# Altium schematic sheet P07 DDRC of Hi3519.SchDoc
size 420 x 297 mm
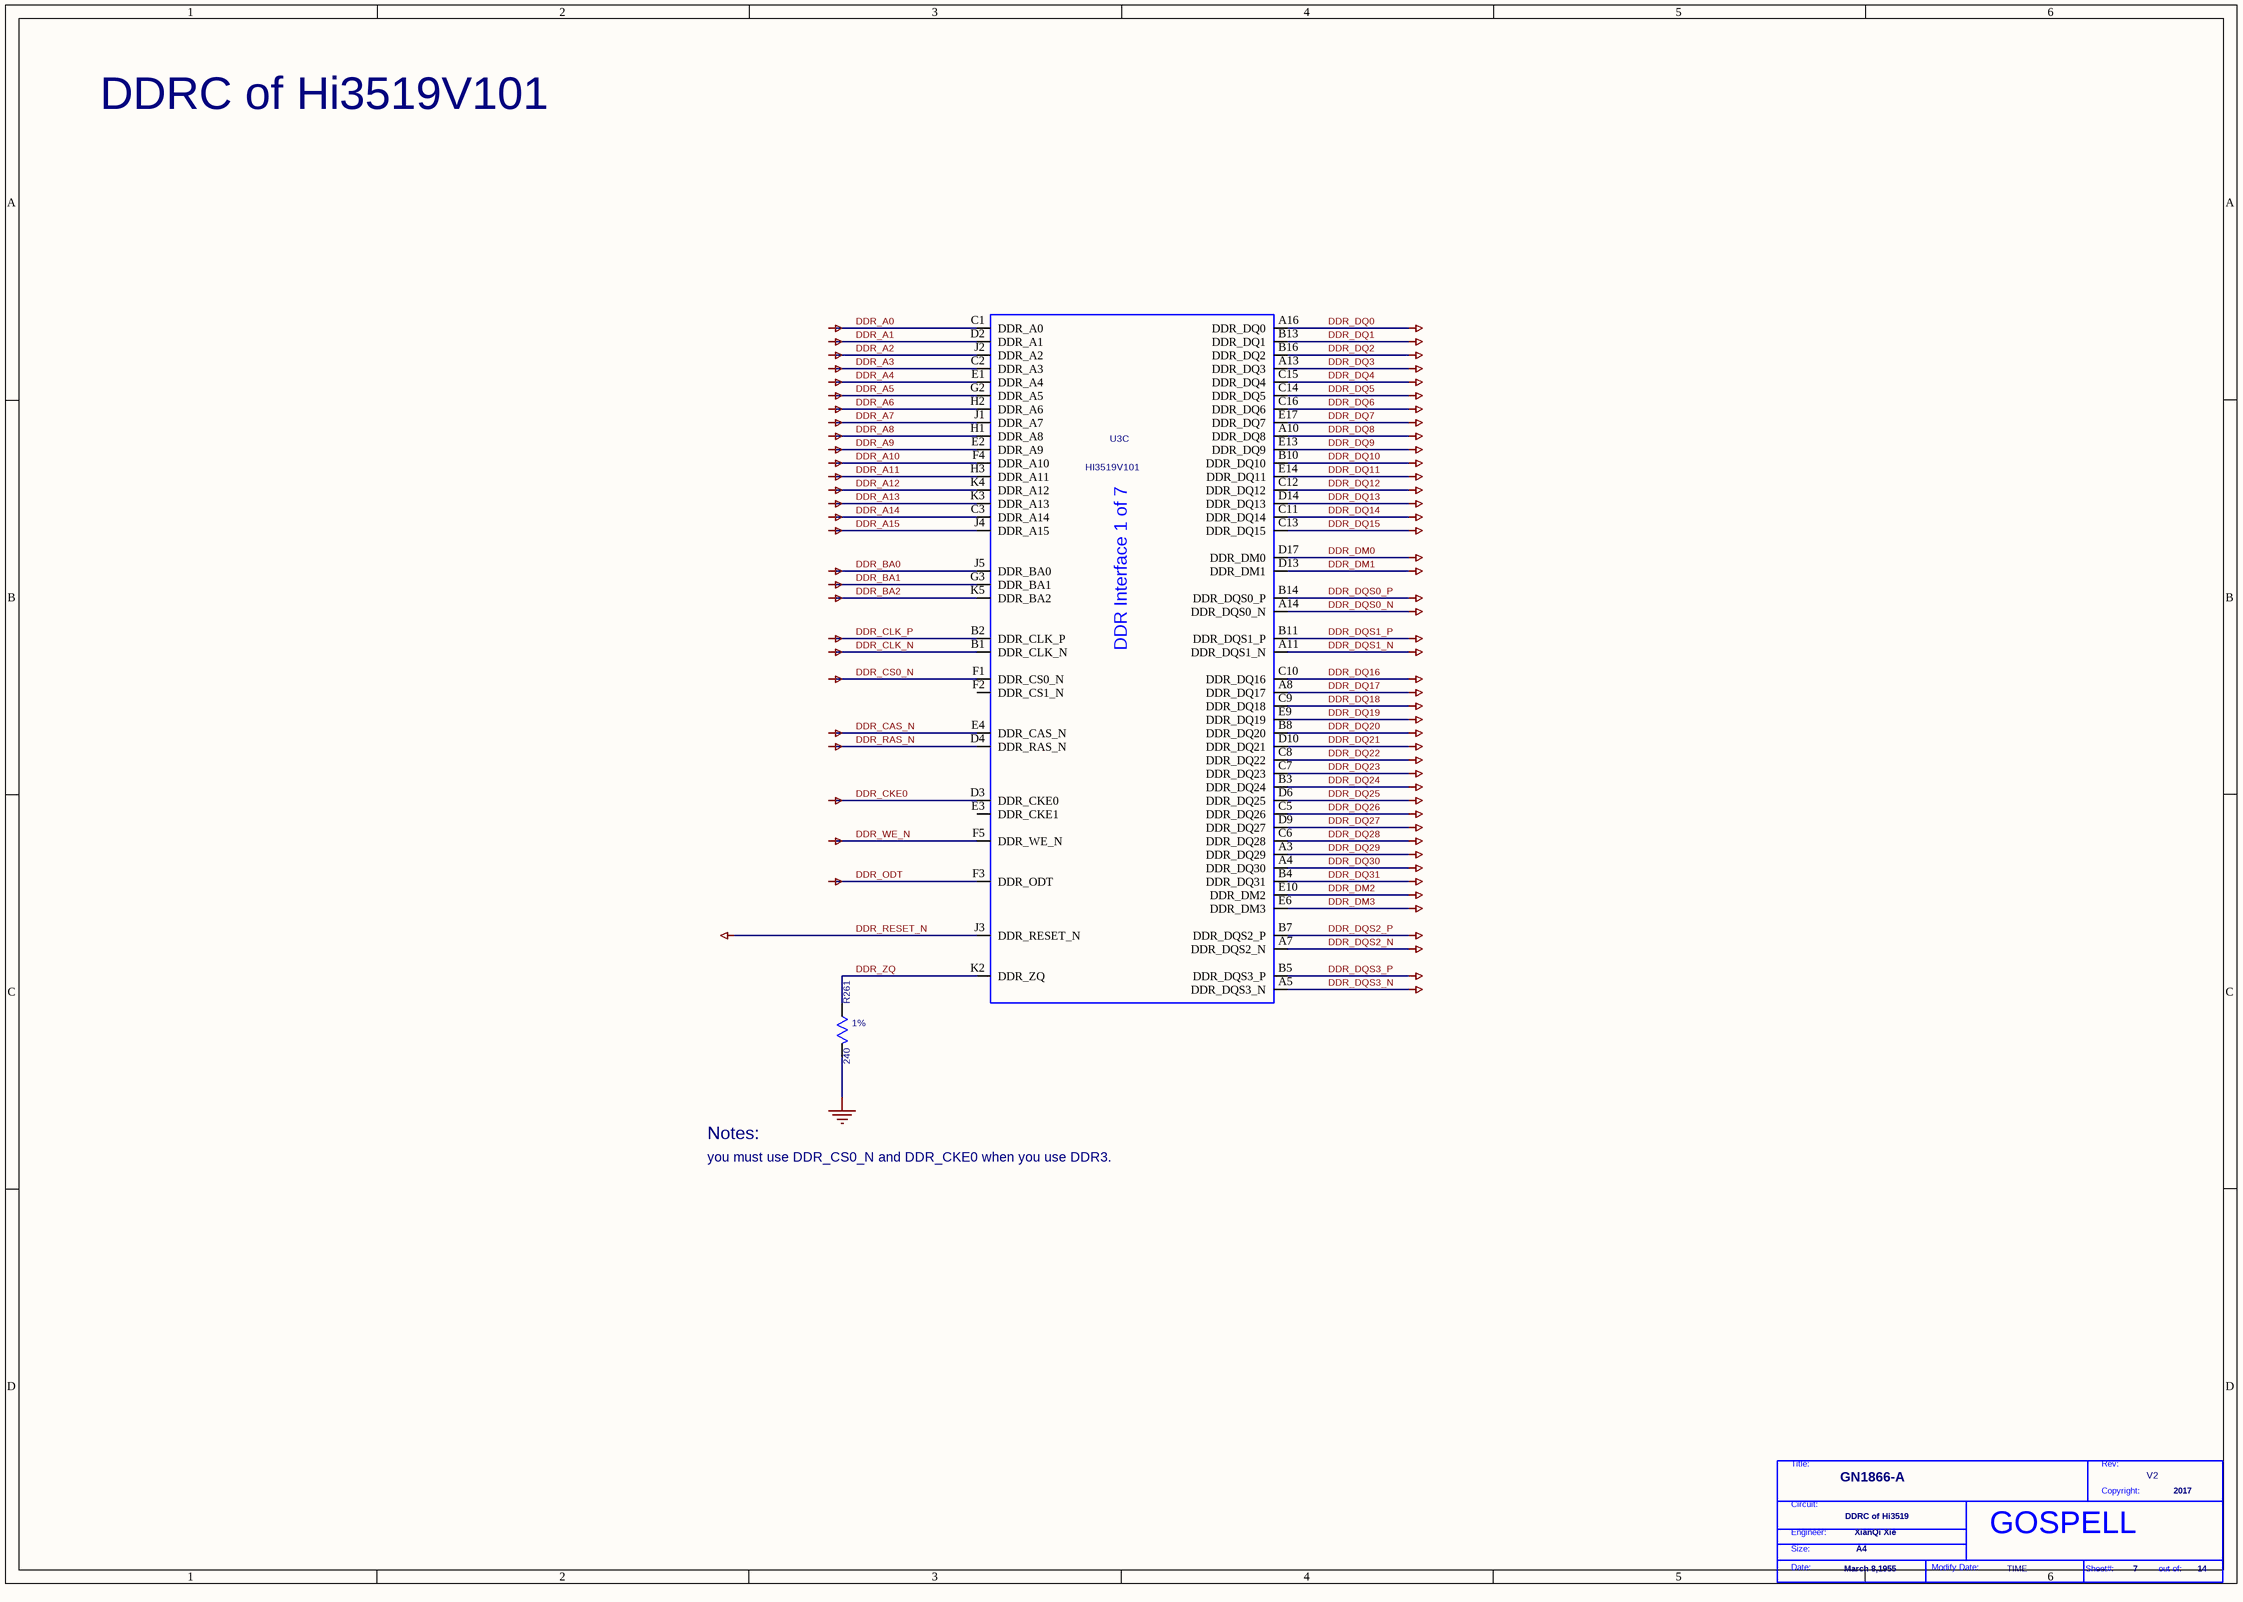
[diagram p0: P07 DDRC of Hi3519.SchDoc]

## Parts
*  Page Modify Date: TIME  Engineer: XianQi Xie  Copyright: 2017  Title: GN1866-A  RevCode: V2  Page Size: A4  Page Create Date: March 8,1955  Page Number: 7  Page Count: 14  Doc: DDRC of Hi3519  (hidden comment: GOSPELL)  (graphical)
R261  240  [SR0402]
U3  DEVICE: HI3519V101  [HBGA524-16-2424]  (hidden comment: HI3519V101_PER)  (part C of 7)

## Nets
DDR_A0: U3.C1(DDR_A0)
DDR_A1: U3.D2(DDR_A1)
DDR_A2: U3.J2(DDR_A2)
DDR_A3: U3.C2(DDR_A3)
DDR_A4: U3.E1(DDR_A4)
DDR_A5: U3.G2(DDR_A5)
DDR_A6: U3.H2(DDR_A6)
DDR_A7: U3.J1(DDR_A7)
DDR_A8: U3.H1(DDR_A8)
DDR_A9: U3.E2(DDR_A9)
DDR_A10: U3.F4(DDR_A10)
DDR_A11: U3.H3(DDR_A11)
DDR_A12: U3.K4(DDR_A12)
DDR_A13: U3.K3(DDR_A13)
DDR_A14: U3.C3(DDR_A14)
DDR_A15: U3.J4(DDR_A15)
DDR_BA0: U3.J5(DDR_BA0)
DDR_BA1: U3.G3(DDR_BA1)
DDR_BA2: U3.K5(DDR_BA2)
DDR_CAS_N: U3.E4(DDR_CAS_N)
DDR_CKE0: U3.D3(DDR_CKE0)
DDR_CLK_N: U3.B1(DDR_CLK_N)
DDR_CLK_P: U3.B2(DDR_CLK_P)
DDR_CS0_N: U3.F1(DDR_CS0_N)
DDR_DM0: U3.D17(DDR_DM0)
DDR_DM1: U3.D13(DDR_DM1)
DDR_DM2: U3.E10(DDR_DM2)
DDR_DM3: U3.E6(DDR_DM3)
DDR_DQ0: U3.A16(DDR_DQ0)
DDR_DQ1: U3.B13(DDR_DQ1)
DDR_DQ2: U3.B16(DDR_DQ2)
DDR_DQ3: U3.A13(DDR_DQ3)
DDR_DQ4: U3.C15(DDR_DQ4)
DDR_DQ5: U3.C14(DDR_DQ5)
DDR_DQ6: U3.C16(DDR_DQ6)
DDR_DQ7: U3.E17(DDR_DQ7)
DDR_DQ8: U3.A10(DDR_DQ8)
DDR_DQ9: U3.E13(DDR_DQ9)
DDR_DQ10: U3.B10(DDR_DQ10)
DDR_DQ11: U3.E14(DDR_DQ11)
DDR_DQ12: U3.C12(DDR_DQ12)
DDR_DQ13: U3.D14(DDR_DQ13)
DDR_DQ14: U3.C11(DDR_DQ14)
DDR_DQ15: U3.C13(DDR_DQ15)
DDR_DQ16: U3.C10(DDR_DQ16)
DDR_DQ17: U3.A8(DDR_DQ17)
DDR_DQ18: U3.C9(DDR_DQ18)
DDR_DQ19: U3.E9(DDR_DQ19)
DDR_DQ20: U3.B8(DDR_DQ20)
DDR_DQ21: U3.D10(DDR_DQ21)
DDR_DQ22: U3.C8(DDR_DQ22)
DDR_DQ23: U3.C7(DDR_DQ23)
DDR_DQ24: U3.B3(DDR_DQ24)
DDR_DQ25: U3.D6(DDR_DQ25)
DDR_DQ26: U3.C5(DDR_DQ26)
DDR_DQ27: U3.D9(DDR_DQ27)
DDR_DQ28: U3.C6(DDR_DQ28)
DDR_DQ29: U3.A3(DDR_DQ29)
DDR_DQ30: U3.A4(DDR_DQ30)
DDR_DQ31: U3.B4(DDR_DQ31)
DDR_DQS0_N: U3.A14(DDR_DQS0_N)
DDR_DQS0_P: U3.B14(DDR_DQS0_P)
DDR_DQS1_N: U3.A11(DDR_DQS1_N)
DDR_DQS1_P: U3.B11(DDR_DQS1_P)
DDR_DQS2_N: U3.A7(DDR_DQS2_N)
DDR_DQS2_P: U3.B7(DDR_DQS2_P)
DDR_DQS3_N: U3.A5(DDR_DQS3_N)
DDR_DQS3_P: U3.B5(DDR_DQS3_P)
DDR_ODT: U3.F3(DDR_ODT)
DDR_RAS_N: U3.D4(DDR_RAS_N)
DDR_RESET_N: U3.J3(DDR_RESET_N)
DDR_WE_N: U3.F5(DDR_WE_N)
GND: R261.2(B)
DDR_ZQ: R261.1(A) U3.K2(DDR_ZQ)

Not connected (* = marked no-connect by the designer): U3 E3(DDR_CKE1) F2(DDR_CS1_N)

## Notes on the sheet
- DDRC of Hi3519V101
- (near R261) 1%
- you must use DDR_CS0_N and DDR_CKE0 when you use DDR3.
- Notes:
- (in symbol GOSPELL) Title:; Rev:; Copyright:; Circuit:; Engineer:; Size:; Date:; Modify Date:; Sheet#:; out of:
- (in symbol HI3519V101_PER_2, part C) DDR Interface 1 of 7

## Library data of the parts
R261 = R_0: PARTS: 1; OriginalSymbolOrigin: (10,20); PINSWAP: (A,B); DEVICE: RC0402FR_07240RL; LEVEL: STD; %208%%161%%192%%224%%195%%251%%179%%198%: 片式厚膜电阻器; COMPONENT_HIGH_MAX: 0.4MM; %215%%232%%214%%181%%212%%202%%208%%237%%198%%171%%178%%238%: +/- 1%; %182%%238%%182%%168%%185%%166%%194%%202%(W): 0.06; %195%%232%%202%%246%: 片式厚膜电阻器-0.0625W-240OHM-+/- 1%-0402-BT; CODE: 7091782; GVALUE: R 1/16W 240±1% 0402; PKG_TYPE: SR0402
U3 = HI3519V101_PER_2: PARTS: 1; OriginalSymbolOrigin: (0,840); LEVEL: STD; HETERO: (HI3519V101_PWR),(HI3519V101_DDR),(HI3519V101_SYS),(HI3519V101_VIVO),(HI3519V101_PER),(HI3519V101_VSS1),(HI3519V101_VSS2); CaptureCellPackProp: HI3519V101_PERC; COMPONENT_HIGH_MAX: 0.98MM; %195%%232%%202%%246%: 请注意是HDI板，建库的时候请注意下-02323838; CODE: G01428016_MODZH; FORWARD_PCB: 1; PKG_TYPE: HBGA524-16-2424; GVALUE: HI3519V101_PER
* = GOSPELL: Cage Code: 2017